# EAGLE design Module (EAGLE 9.6.2)
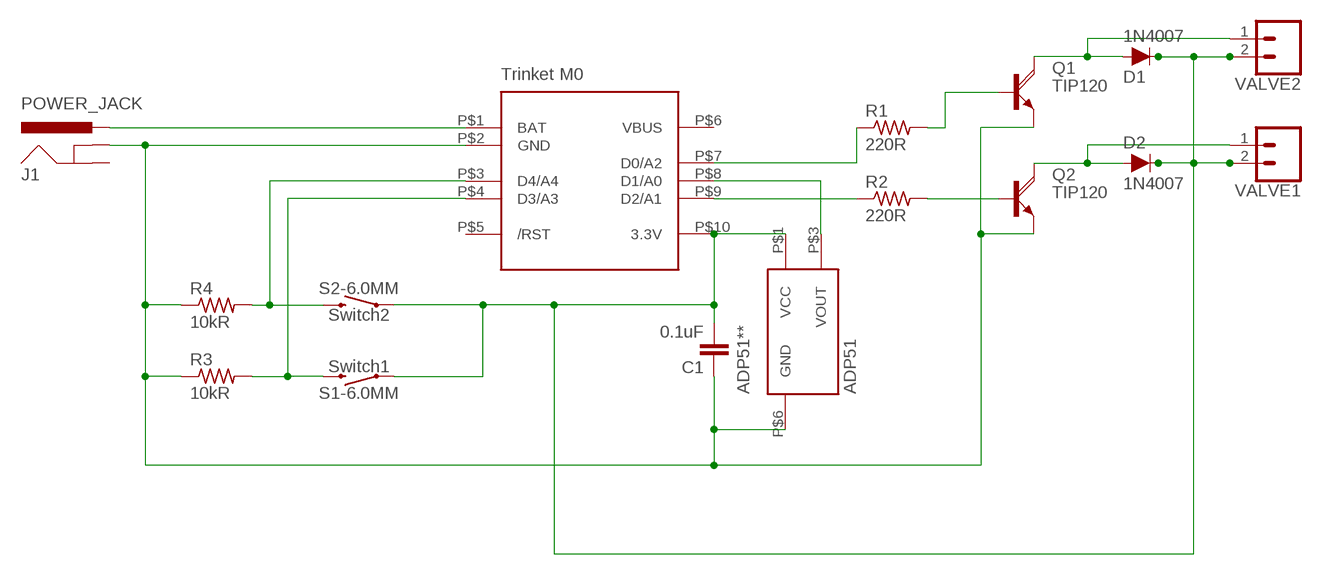
[diagram p0: schematic, sheet 1]

## Parts
C1  0.1uF  0.1UF-KIT-EZ-50V-20%  [CAP-PTH-SMALL-KIT]
D1  1N4007  DIODE-1N4148  [DIODE-1N4148]
D2  1N4007  DIODE-1N4148  [DIODE-1N4148]
J1  POWER_JACK  [POWER_JACK_PTH]
Q1  TIP120  BD679  [TO126AV]
Q2  TIP120  BD679  [TO126AV]
R1  220R  R-US_0207/10  [0207/10]
R2  220R  R-US_0207/10  [0207/10]
R3  10kR  R-US_0207/10  [0207/10]
R4  10kR  R-US_0207/10  [0207/10]
S1-6.0MM  Switch1  MOMENTARY-SWITCH-SPST-PTH-6.0MM  [TACTILE_SWITCH_PTH_6.0MM]
S2-6.0MM  Switch2  MOMENTARY-SWITCH-SPST-PTH-6.0MM  [TACTILE_SWITCH_PTH_6.0MM]
U$1  TRINKET-M0  [TRINKET-M0]
U$2  ADP51  [ADP5121]
VALVE1  CONN_02POLAR  [MOLEX-1X2]
VALVE2  CONN_02POLAR  [MOLEX-1X2]

## Nets
N$2: J1.PWR U$1.P$1(BAT)
N$3: C1.2 D1.C D2.C S1-6.0MM.1 S2-6.0MM.1 U$1.P$10(3.3V) U$2.P$1(VCC) VALVE1.2 VALVE2.2
N$4: R4.2 S2-6.0MM.3 U$1.P$3(D4/A4)
N$5: R3.2 S1-6.0MM.3 U$1.P$4(D3/A3)
N$6: Q1.B R1.2
N$7: Q2.B R2.2
N$8: R1.1 U$1.P$7(D0/A2)
N$9: R2.1 U$1.P$9(D2/A1)
N$11: D1.A Q1.C VALVE2.1
N$12: D2.A Q2.C VALVE1.1
N$14: C1.1 J1.GNDBREAK Q1.E Q2.E R3.1 R4.1 U$1.P$2(GND) U$2.P$6(GND)
N$15: U$1.P$8(D1/A0) U$2.P$3(VOUT)
Unconnected: J1.GND U$1.P$5(/RST) U$1.P$6(VBUS)

## Library data of the parts
C1 = SparkFun-Capacitors:0.1UF: 0.1µF ceramic capacitors A capacitor is a passive two-terminal electrical component used to store electrical energy temporarily in an electric field.; PROD_ID: CAP-08370
D1 D2 = SparkFun-DiscreteSemi:DIODE: Diode These are standard reverse protection diodes and small signal diodes. SparkFun Products: SparkFun SparkPunk Sound Kit <https://www.sparkfun.com/products/11177> SparkFun ESP8266 Thing <https://www.sparkfun.com/products/13231>; PROD_ID: DIO-08378; VALUE: 200mA/100V/1V
J1 = SparkFun-Connectors:POWER_JACK: Power Jack Connector This is the standard 5.5mm barrel jack for power. The PTH is the most common, proven, reliable, footprint. The Slot footprint only works if the mill layer is transmitted to the PCB fab house so be warned. Here are the connectors we sell at SparkFun: DC Barrel Power Jack/Connector <https://www.sparkfun.com/products/119> (PRT-00119) DC Barrel Power Jack/Connector (SMD) <https://www.sparkfun.com/products/12748> (PRT-12748) DC Barrel Jack Adapter - Breadboard Compatible <https://www.sparkfun.com/products/10811> (PRT-10811) It is used on this SparkFun product (and many, many others): SparkFun RedBoard - Programmed with Arduino <https://www.sparkfun.com/products/12757> (DEV-12757) Also, if you need a mating power supply or connector, please check these out: Wall Adapter Power Supply - 9VDC 650mA <https://www.sparkfun.com/products/298> (TOL-00298) DC Barrel Jack Adapter - Male <https://www.sparkfun.com/products/10287> (PRT-10287); PROD_ID: CONN-08197
Q1 Q2 = transistor-power:BD679: NPN DARLINGTON TRANSISTOR
R1-R4 = adafruit:R-US_: RESISTOR, American symbol
S1-6.0MM S2-6.0MM = SparkFun-Switches:MOMENTARY-SWITCH-SPST: Momentary Switch (Pushbutton) - SPST Normally-open (NO) SPST momentary switches (buttons, pushbuttons). Variants PTH-12MM - 12mm square, through-hole Momentary Pushbutton Switch - 12mm Square <https://www.sparkfun.com/products/9190> (COM-09190) PTH-6.0MM, PTH-6.0MM-KIT - 6.0mm square, through-hole Mini Pushbutton Switch <https://www.sparkfun.com/products/97> (COM-00097) KIT package intended for soldering kit's - only one side of pads' copper is exposed. PTH-RIGHT-ANGLE-KIT - Right-angle, through-hole Right Angle Tactile Button <https://www.sparkfun.com/products/10791> - Used on SparkFun BigTime Watch Kit <https://www.sparkfun.com/products/11734> SMD-12MM - 12mm square, surface-mount Tactile Button - SMD (12mm) <https://www.sparkfun.com/products/12993> (COM-12993) Used on SparkFun PicoBoard <https://www.sparkfun.com/products/11888> SMD-4.5MM - 4.5mm Square Trackball Switch Used on SparkFun Blackberry Trackballer Breakout <https://www.sparkfun.com/products/13169> SMD-4.6MMX2.8MM - 4.60mm x 2.80mm, surface mount Used on SparkFun SAMD21 Mini Breakout <https://www.sparkfun.com/products/13664> SMD-5.2MM, SMD-5.2-REDUNDANT - 5.2mm square, surface-mount Mini Pushbutton Switch - SMD <https://www.sparkfun.com/products/8720> (COM-08720) Used on Arduino Pro Mini <https://www.sparkfun.com/products/11114> REDUNDANT package connects both switch circuits together SMD-6.0X3.5MM - 6.0 x 3.5mm, surface mount Momentary Reset Switch SMD <https://www.sparkfun.com/products/8229> (COM-08229) SMD-6.2MM-TALL - 6.2mm square, surface mount Tactile Button - SMD (6mm) <https://www.sparkfun.com/products/12992> Used on SparkFun Digital Sandbox <https://www.sparkfun.com/products/12651> SMD-RIGHT-ANGLE - Right-angle, surface mount Used on SparkFun Block for Intel® Edison - Arduino <https://www.sparkfun.com/products/13036>; PROD_ID: SWCH-08441; SF_SKU: COM-00097
U$1 = adafruit:TRINKET-M0: Adafruit Trinket M0
U$2 = adafruit:ADP51**: Panasonic pressure sensor series See the below for details. https://www.mouser.dk/datasheet/2/315/ADE8000C209-1286221.pdf I designed the device specifically for ADP5121.
VALVE1 VALVE2 = SparkFun-Connectors:CONN_02: Multi connection point. Often used as Generic Header-pin footprint for 0.1 inch spaced/style header connections On any of the 0.1 inch spaced packages, you can populate with these: Break Away Headers - Straight <https://www.sparkfun.com/products/116> (PRT-00116) Break Away Male Headers - Right Angle <https://www.sparkfun.com/products/553> (PRT-00553) Female Headers <https://www.sparkfun.com/products/115> (PRT-00115) Break Away Headers - Machine Pin <https://www.sparkfun.com/products/117> (PRT-00117) Break Away Female Headers - Swiss Machine Pin <https://www.sparkfun.com/products/743> (PRT-00743) For SCREWTERMINALS and SPRING TERMINALS visit here: Screw Terimnals on SparkFun.com <https://www.sparkfun.com/search/results?term=Screw+Terminals> (5mm/3.5mm/2.54mm spacing) This device is also useful as a general connection point to wire up your design to another part of your project. Our various solder wires solder well into these plated through hole pads. Hook-Up Wire - Assortment (Stranded, 22 AWG) <https://www.sparkfun.com/products/11375> (PRT-11375) Hook-Up Wire - Assortment (Solid Core, 22 AWG) <https://www.sparkfun.com/products/11367> (PRT-11367) View the entire wire category on our website here <https://www.sparkfun.com/categories/141> Special notes: Molex polarized connector foot print use with: PRT-08233 with associated crimp pins and housings. 2.54_SCREWTERM for use with PRT-10571. 3.5mm Screw Terminal footprints for PRT-08084 5mm Screw Terminal footprints for use with PRT-08432; SF_ID: PRT-09918

## Board
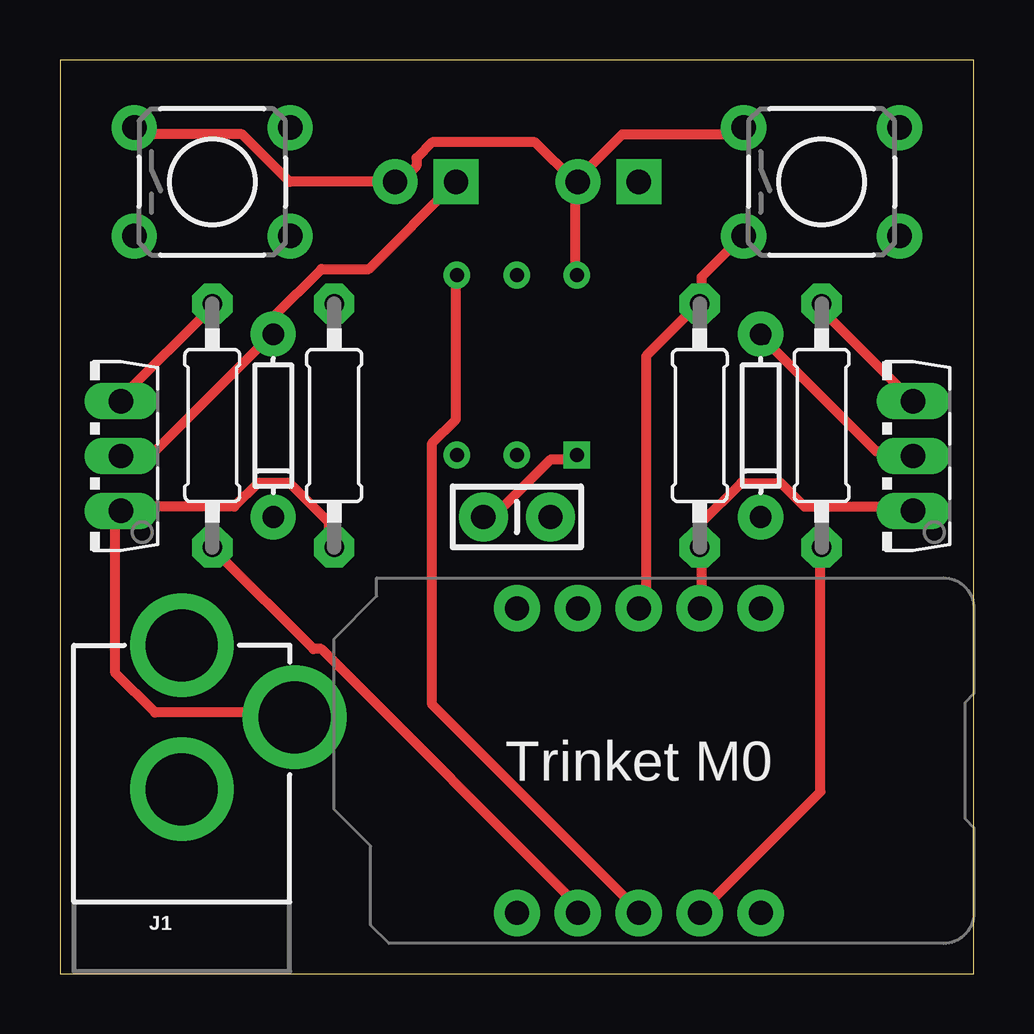
[diagram p1: board, top side]
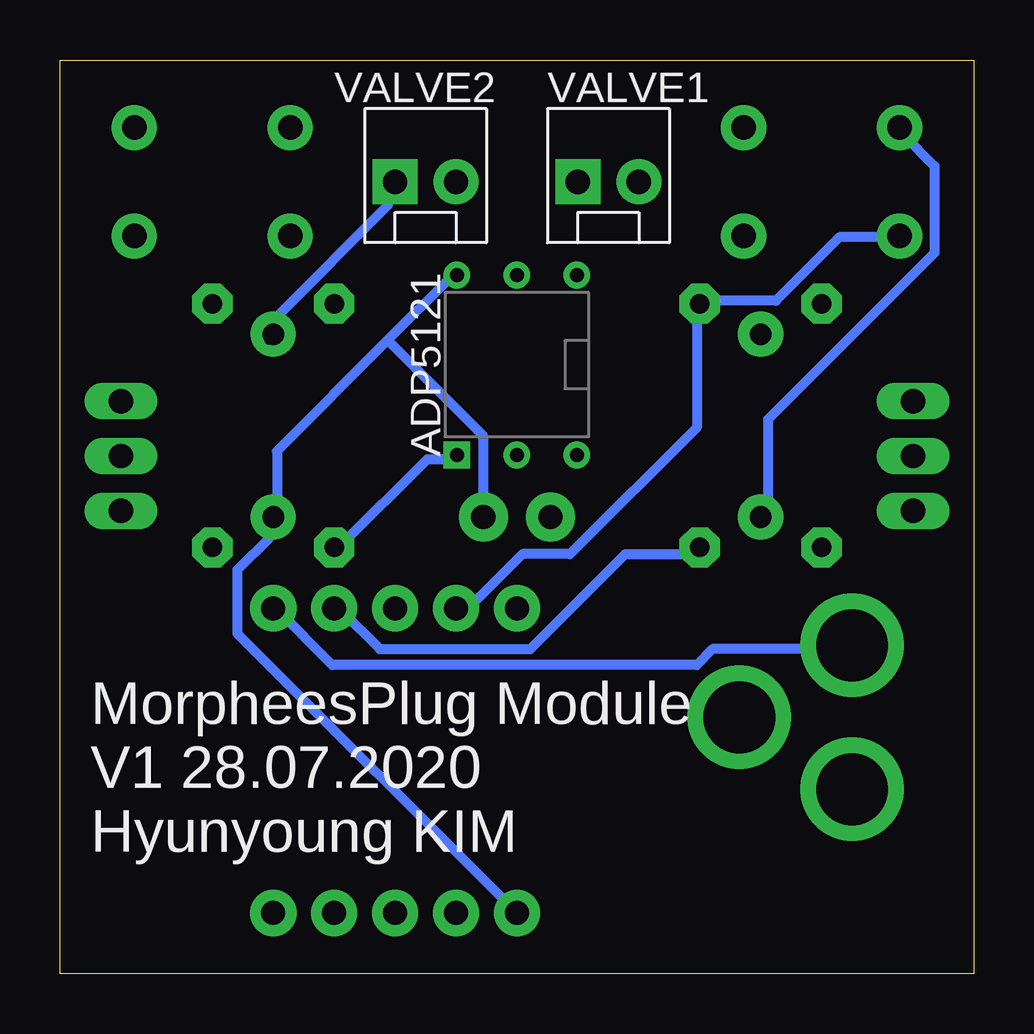
[diagram p2: board, bottom side, seen from below]

Size 38.1 x 38.1 mm. Coordinates in mm from the lower left corner, seen from the top.
Outline: 0,0 38.1,0 38.1,38.1 0,38.1 0,0
Copper layers (1*16): Top 0.035mm / dielectric 1.5mm / Bottom 0.035mm
Design rules "default *": minimum track width 16mil, minimum drill 0.35mm, track to track 10mil, track to pad 10mil, pad to pad 10mil, via to via 10mil, smd to smd 6mil, copper to edge 40mil, drill to drill 6mil, minimum pad ring 10mil, minimum via ring 8mil, stop-mask expansion 4mil, vias tented up to drill 0mil, thermal gap 10mil

### Footprints (pad centres in the part's own frame; a part is rotated, then mirrored left to right if it is on the bottom)
CAP-PTH-SMALL-KIT = drill 1.016 pad 2.032: 1 -1.397,0; 2 1.397,0
DIODE-1N4148 = drill 0.9 pad 1.88: A -3.81,0; C 3.81,0
POWER_JACK_PTH = drill 2.997 pad 4.318: GND 0,7.7; GNDBREAK 4.7,10.7; PWR 0,13.7
TO126AV = drill 1.016 long: B 2.286,-1.27; C 0,-1.27; E -2.286,-1.27
0207/10 = drill 0.813 pad 1.676 octagon: 1 -5.08,0; 2 5.08,0
TACTILE_SWITCH_PTH_6.0MM = drill 1.016 pad 1.88: 1 -3.251,2.261; 2 3.251,2.261; 3 -3.251,-2.261; 4 3.251,-2.261
TRINKET-M0 = drill 1 pad 1.93: P$1 -6.35,6.35; P$2 -6.35,3.81; P$3 -6.35,1.27; P$4 -6.35,-1.27; P$5 -6.35,-3.81; P$6 6.35,6.35; P$7 6.35,3.81; P$8 6.35,1.27; P$9 6.35,-1.27; P$10 6.35,-3.81
ADP5121 = drill 0.6: P$1 -2.5,3.73; P$2 0,3.73; P$3 2.5,3.73; P$4 2.5,-3.77; P$5 0,-3.77 | drill 0.6 square: P$6 -2.5,-3.77
MOLEX-1X2 = drill 1.016 pad 1.88 square: 1 0,0 | drill 1.016 pad 1.88: 2 2.54,0

### Placement (x,y rotation side)
C1  19.05,19.05 0 top
D1  29.21,22.86 270 top
D2  8.89,22.86 270 top
J1  5.08,0 0 top
Q1  34.29,21.59 90 top
Q2  1.27,21.59 90 top
R1  31.75,22.86 90 top
R2  6.35,22.86 90 top
R3  11.43,22.86 90 top
R4  26.67,22.86 90 top
S1-6.0MM  6.35,33.02 0 top
S2-6.0MM  31.75,33.02 0 top
U$1  22.86,8.89 270 top
U$2  ADP51*  [ADP5121]  19.05,25.4 0 bottom
VALVE1  16.51,33.02 0 bottom
VALVE2  24.13,33.02 0 bottom

### Tracks (layer width: path | path; a pad name or v marks a point on that pad's centre or on a via)
N$2
  Bottom 0.406: U$1.P$1 29.06,15.19 26.75,12.88 11.56,12.88 10.9,13.54 5.28,13.54 J1.PWR
N$3  (via drill 0.35)
  Top 0.406: 21.46,33.02 21.46,29.39 U$2.P$1 | v29.06,19.15 D1.C v29.39,18.82 | 21.46,33.02 19.81,34.67 15.52,34.67 14.86,34.01 14.86,33.68 14.2,33.02 VALVE1.2 9.58,33.02 7.59,35 3.3,35 S1-6.0MM.1 | 21.46,33.02 23.44,35 28.4,35 S2-6.0MM.1 | 21.46,33.02 VALVE2.2
  Bottom 0.406: D2.C 8.59,19.15 8.59,23.11 1.65,30.05 1.65,33.68 2.97,35 S1-6.0MM.1 | v29.06,19.15 29.06,21.79 24.43,26.42 | 24.43,26.42 21.79,29.06 U$2.P$1 | U$1.P$10 30.71,14.2 30.71,16.84 29.39,18.16 v29.39,18.82 | 24.43,26.42 20.47,22.45 20.47,19.15 C1.2
N$4
  Top 0.406: S2-6.0MM.3 28.4,30.71 26.75,29.06 26.75,28.07 R4.2 26.42,27.74 24.43,25.76 24.43,15.52 U$1.P$3
N$5
  Bottom 0.406: S1-6.0MM.3 3.3,30.71 5.61,30.71 8.26,28.07 11.23,28.07 R3.2 11.56,27.74 11.56,22.78 16.84,17.5 18.82,17.5 20.8,15.52 21.46,15.52 U$1.P$4
N$6
  Top 0.406: Q1.B 31.7,27.74 R1.2
N$7
  Top 0.406: Q2.B 2.64,24.11 6.27,27.74 R2.2
N$8
  Top 0.406: R1.1 31.7,17.5 31.7,7.59 26.75,2.64 U$1.P$7
N$9
  Top 0.406: R2.1 6.6,17.5 10.57,13.54 10.9,13.54 21.79,2.64 U$1.P$9
N$11  (via drill 0.35)
  Top 0.406: v29.39,26.42 34.01,21.79 35.33,21.79 Q1.C | v29.06,26.75 D1.A
  Bottom 0.406: v29.39,26.42 D1.A | v29.06,26.75 29.06,27.41 24.43,32.03 24.43,33.02 VALVE2.1
N$12
  Top 0.406: Q2.C 2.64,21.79 3.96,21.79 8.59,26.42 D2.A 8.91,26.75 8.91,27.41 10.9,29.39 12.88,29.39 VALVE1.1
N$14
  Top 0.406: R3.1 11.23,17.83 11.23,18.82 9.58,20.47 8.26,20.47 7.26,19.48 2.64,19.48 Q2.E 2.31,19.15 2.31,12.55 3.96,10.9 9.58,10.9 J1.GNDBREAK | U$2.P$6 21.46,21.46 20.47,21.46 17.83,18.82 C1.1 | Q1.E 35.33,19.48 31.04,19.48 30.05,20.47 28.4,20.47 26.75,18.82 26.75,17.83 R4.1 26.75,17.5 26.75,15.52 U$1.P$2
  Bottom 0.406: U$2.P$6 21.79,21.46 22.78,21.46 26.42,17.83 R4.1 | R3.1 11.56,17.5 14.53,17.5 18.49,13.54 24.77,13.54 26.42,15.19 U$1.P$2
N$15
  Top 0.406: U$2.P$3 16.51,29.06 16.51,23.11 15.52,22.12 15.52,11.23 24.11,2.64 U$1.P$8

### Text on the board
bPlace: MorpheesPlug Module / V1 28.07.2020 / Hyunyoung KIM
bNames: ADP5121
tValues: (-) | (-)